# Altium schematic sheet Candunio.SchDoc
size A4
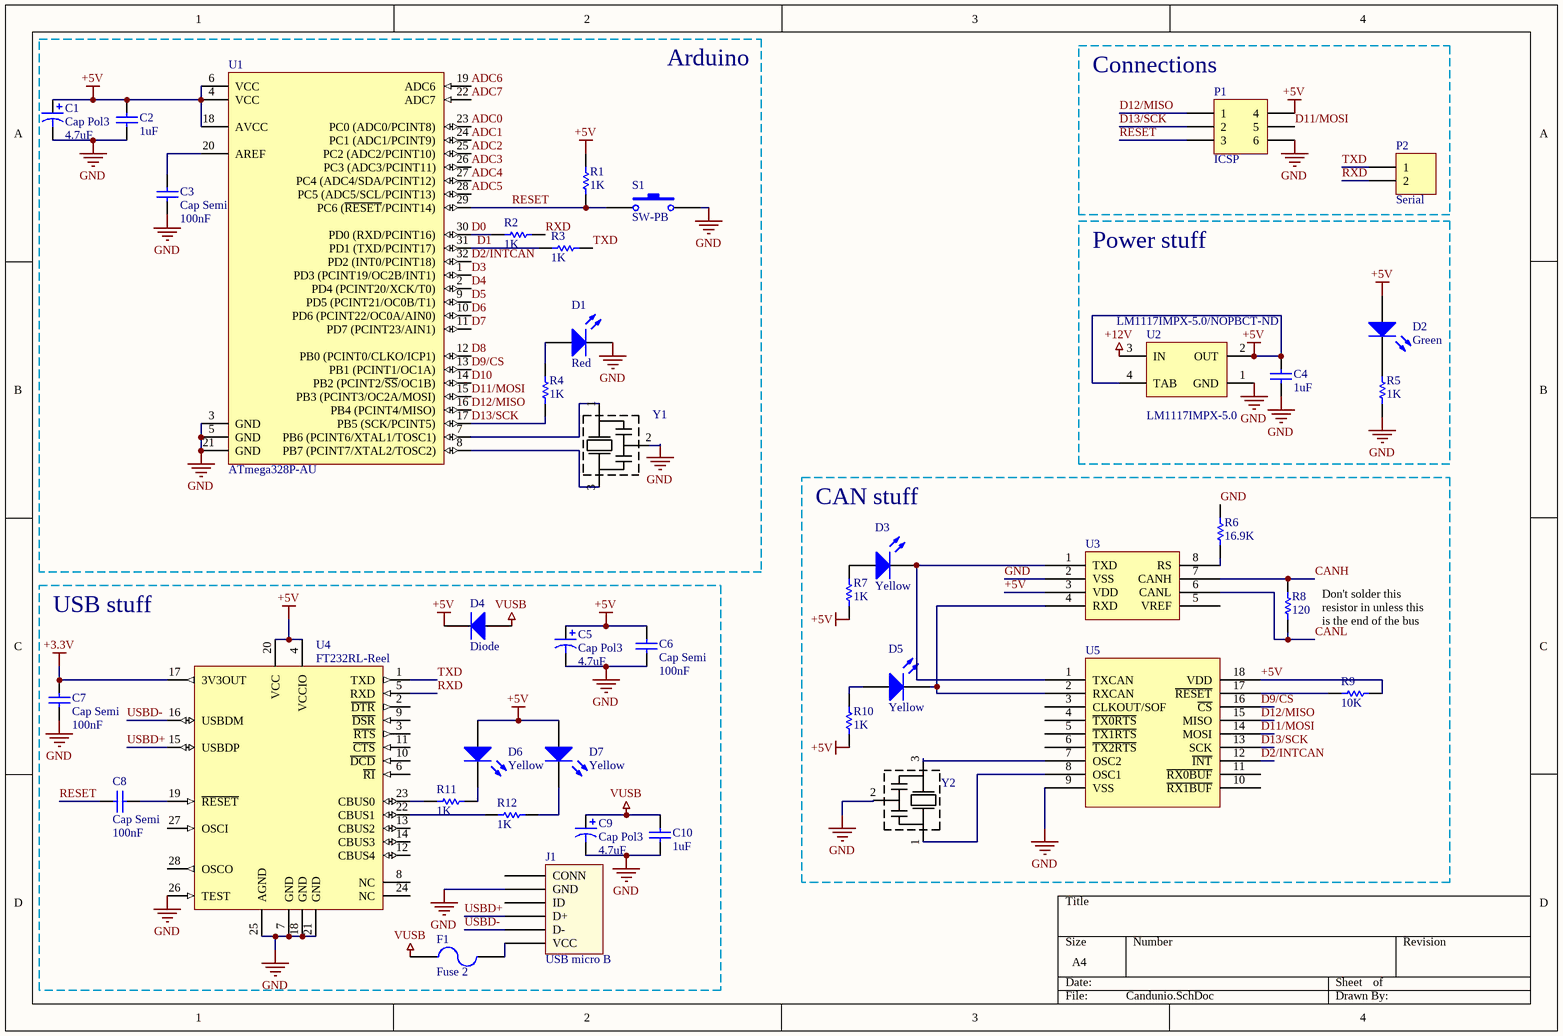
[diagram p0: Candunio.SchDoc]

## Parts
C1  Cap Pol3  value 4.7uF  [C1206]
C2  1uF  [C1206]
C3  Cap Semi  value 100nF  [C1206]
C4  1uF  [C1206]
C5  Cap Pol3  value 4.7uF  [C1206]
C6  Cap Semi  value 100nF  [C1206]
C7  Cap Semi  value 100nF  [C1206]
C8  Cap Semi  value 100nF  [C1206]
C9  Cap Pol3  value 4.7uF  [C1206]
C10  1uF  [C1206]
D1  Red  [3.2X1.6X1.1]
D2  Green  [3.2X1.6X1.1]
D3  Yellow  [3.2X1.6X1.1]
D4  Diode  [SMC]
D5  Yellow  [3.2X1.6X1.1]
D6  Yellow  [3.2X1.6X1.1]
D7  Yellow  [3.2X1.6X1.1]
F1  Fuse 2  [1812]
J1  USB micro B  [1050170001]
P1  ICSP  [HDR2X3_CEN]
P2  Serial  [HDR1X2]
R1  1K  [C1206]
R2  1K  [C1206]
R3  1K  [C1206]
R4  1K  [C1206]
R5  1K  [C1206]
R6  16.9K  [C1206]
R7  1K  [C1206]
R8  120  [C1206]
R9  10K  [C1206]
R10  1K  [C1206]
R11  1K  [C1206]
R12  1K  [C1206]
S1  SW-PB  [C1206]
U1  ATmega328P-AU  [32A_N]
U2  LM1117IMPX-5.0  Supplier Part Number: LM1117IMPX-5.0/NOPBCT-ND  [MP04A_N]
U3  MCP2551-E/SN  [SOIC127P600X175-8M]  (value not drawn)
U4  FT232RL-Reel  [SSOP-28_N]
U5  MCP2515-E/ST  [SOIC127P1030X265-18M]  (value not drawn)
Y1  CSTCE16M0V53-R0  [CSTCE16M0V53-R0]  (value not drawn)
Y2  CSTCE16M0V53-R0  [CSTCE16M0V53-R0]  (value not drawn)

## Blocks framed on the sheet
Arduino: C1-C3 D1 R1-R4 S1 U1 Y1
Connections: P1 P2
Power stuff: C4 D2 R5 U2
CAN stuff: D3 D5 R6-R10 U3 U5 Y2
USB stuff: C5-C10 D4 D6 D7 F1 J1 R11 R12 U4

## Nets
+3.3V: C7.1 U4.17(3V3OUT)
+5V: C1.1 C2.1 C4.1 C5.1 C6.1 D2.1(A) D4.2(K) D6.1(A) D7.1(A) P1.4 R1.1 R7.1 R9.2 R10.2 U1.4(VCC) U1.6(VCC) U1.18(AVCC) U2.2(OUT) U2.4(TAB) U3.3(VDD) U4.4(VCCIO) U4.20(VCC) U5.18(VDD)
+12V: U2.3(IN)
GND: C1.2 C2.2 C3.2 C4.2 C5.2 C6.2 C7.2 C9.2 C10.2 D1.2(K) J1.5(GND) P1.6 R5.2 R6.1 S1.2 U1.3(GND) U1.5(GND) U1.21(GND) U2.1(GND) U3.2(VSS) U4.7(GND) U4.18(GND) U4.21(GND) U4.25(AGND) U4.26(TEST) U5.9(VSS) Y1.2 Y2.2
VUSB: C9.1 C10.1 D4.1(A) F1.1
ADC0: U1.23(PC0_(ADC0/PCINT8))
ADC1: U1.24(PC1_(ADC1/PCINT9))
ADC2: U1.25(PC2_(ADC2/PCINT10))
ADC3: U1.26(PC3_(ADC3/PCINT11))
ADC4: U1.27(PC4_(ADC4/SDA/PCINT12))
ADC5: U1.28(PC5_(ADC5/SCL/PCINT13))
ADC6: U1.19(ADC6)
ADC7: U1.22(ADC7)
CANH: R8.1 U3.7(CANH)
CANL: R8.2 U3.6(CANL)
D0: R2.1 U1.30(PD0_(RXD/PCINT16))
D1: R3.1 U1.31(PD1_(TXD/PCINT17))
D2/INTCAN: U1.32(PD2_(INT0/PCINT18)) U5.12(~{INT})
D3: U1.1(PD3_(PCINT19/OC2B/INT1))
D4: U1.2(PD4_(PCINT20/XCK/T0))
D5: U1.9(PD5_(PCINT21/OC0B/T1))
D6: U1.10(PD6_(PCINT22/OC0A/AIN0))
D7: U1.11(PD7_(PCINT23/AIN1))
D8: U1.12(PB0_(PCINT0/CLKO/ICP1))
D9/CS: U1.13(PB1_(PCINT1/OC1A)) U5.16(~{CS})
D10: U1.14(PB2_(PCINT2/~{SS}/OC1B))
D11/MOSI: P1.5 U1.15(PB3_(PCINT3/OC2A/MOSI)) U5.14(MOSI)
D12/MISO: P1.1 U1.16(PB4_(PCINT4/MISO)) U5.15(MISO)
D13/SCK: P1.2 R4.2 U1.17(PB5_(SCK/PCINT5)) U5.13(SCK)
RESET: C8.1 P1.3 R1.2 S1.1 U1.29(PC6_(~{RESET}/PCINT14))
RXD: P2.2 R2.2 U4.5(RXD)
TXD: P2.1 R3.2 U4.1(TXD)
USBD+: J1.3(D+) U4.15(USBDP)
USBD-: J1.2(D-) U4.16(USBDM)
NetC3_1: C3.1 U1.20(AREF)
NetC8_2: C8.2 U4.19(~{RESET})
NetD1_1: D1.1(A) R4.1
NetD2_2: D2.2(K) R5.1
NetD3_1: D3.1(A) R7.2
NetD3_2: D3.2(K) U3.1(TXD) U5.1(TXCAN)
NetD5_1: D5.1(A) R10.1
NetD5_2: D5.2(K) U3.4(RXD) U5.2(RXCAN)
NetD6_2: D6.2(K) R11.2
NetD7_2: D7.2(K) R12.2
NetF1_2: F1.2 J1.1(VCC)
NetR6_2: R6.2 U3.8(RS)
NetR9_1: R9.1 U5.17(~{RESET})
NetR11_1: R11.1 U4.23(CBUS0)
NetR12_1: R12.1 U4.22(CBUS1)
NetU1_7: U1.7(PB6_(PCINT6/XTAL1/TOSC1)) Y1.1
NetU1_8: U1.8(PB7_(PCINT7/XTAL2/TOSC2)) Y1.3
NetU5_7: U5.7(OSC2) Y2.3
NetU5_8: U5.8(OSC1) Y2.1

Not connected (* = marked no-connect by the designer): J1 0(CONN) 4(ID); U3 5(VREF); U4 2(~{DTR}) 3(~{RTS}) 6(~{RI}) 8(NC) 9(~{DSR}) 10(~{DCD}) 11(~{CTS}) 12(CBUS4) 13(CBUS2) 14(CBUS3) 24(NC) 27(OSCI) 28(OSCO); U5 3(CLKOUT/SOF) 4(~{TX0RTS}) 5(~{TX1RTS}) 6(~{TX2RTS}) 10(~{RX1BUF}) 11(~{RX0BUF})

## Notes on the sheet
- (near R8) Don't solder this resistor in unless this is the end of the bus

## Library data of the parts
C1 C5 C9 = Cap Pol3: Polarized Capacitor (Surface Mount); Manufacturer: Kyocera AVX; Manufacturer Part Number: 12063C475KAT2A; Tolerance: 10%; Voltage Rating: 25V; Dielectric: X7R; Published: 8-Jun-2000; LatestRevisionDate: 29-May-2009; LatestRevisionNote: IPC-7351 Footprint Added.; PackageReference: C0805; Publisher: Altium Limited; PackageDescription: Chip Capacitor; Supplier 1: Digi-Key; Stock 1: 0; Pricing 1: 1=0.5, 10=0.345, 100=0.207, 500=0.15526, 1000=0.1311 (USD); Mount: Surface Mount; Case/Package: 1206; Number of Pins: 2; Case Code (Metric): 3216; Case Code (Imperial): 1206; Contact Plating: Tin,Matte; Min Operating Temperature: -55°C; Max Operating Temperature: 125°C; Capacitance: 4.7uF; Packaging: Tape and Reel; Package Quantity: 1; Voltage Rating (DC): 25V; Termination: SMD/SMT; Voltage: 25V; Length: 3.2mm; Height: 1.78mm; Width: 0.063inch; Thickness: 0.07inch; Depth: 1.6mm; Radiation Hardening: No; REACH SVHC: No SVHC; Lead Free: Lead Free; ComponentLink1URL: https://datasheet.ciiva.com/2988/cx7r-2988115.pdf; ComponentLink1Description: https://datasheet.ciiva.com/2988/cx7r-2988115.pdf; ComponentLink2URL: https://datasheet.ciiva.com/7833/84526-7833366.pdf; ComponentLink2Description: https://datasheet.ciiva.com/7833/84526-7833366.pdf; ComponentLink3URL: https://datasheet.ciiva.com/16315/cx7r-16315830.pdf; ComponentLink3Description: https://datasheet.ciiva.com/16315/cx7r-16315830.pdf; ComponentLink4URL: https://datasheet.ciiva.com/153/cx7r-153207.pdf; ComponentLink4Description: https://datasheet.ciiva.com/153/cx7r-153207.pdf; ComponentLink5URL: https://datasheet.ciiva.com/7833/84526-7833367.pdf; ComponentLink5Description: https://datasheet.ciiva.com/7833/84526-7833367.pdf; ComponentLink6URL: https://datasheet.ciiva.com/153/cx7r-153208.pdf; ComponentLink6Description: https://datasheet.ciiva.com/153/cx7r-153208.pdf; ComponentLink7URL: https://datasheet.ciiva.com/7833/cx7r-7833368.pdf; ComponentLink7Description: https://datasheet.ciiva.com/7833/cx7r-7833368.pdf; ComponentLink8URL: https://datasheet.ciiva.com/153/cx7r-153209.pdf; ComponentLink8Description: https://datasheet.ciiva.com/153/cx7r-153209.pdf; ComponentLink9URL: https://datasheet.ciiva.com/5417/cx7r-218113-5417949.pdf; ComponentLink9Description: https://datasheet.ciiva.com/5417/cx7r-218113-5417949.pdf; ComponentLink10URL: https://datasheet.ciiva.com/28611/cx7r-28611725.pdf; ComponentLink10Description: https://datasheet.ciiva.com/28611/cx7r-28611725.pdf; ComponentLink11URL: https://datasheet.ciiva.com/11786/0900766b80dc2409-11786382.pdf; ComponentLink11Description: https://datasheet.ciiva.com/11786/0900766b80dc2409-11786382.pdf; Supplier 2: Digi-Key; Supplier Part Number: 1276-1055-1-ND
C2 C4 C10 = Cap Semi: Capacitor (Semiconductor SIM Model); Manufacturer: Murata; Manufacturer Part Number: GRM31MR71H105KA88L; Material: Ceramic; Tolerance: 10%; Voltage Rating: 50V; Dielectric: X7R; Published: 8-Jun-2000; LatestRevisionDate: 29-May-2009; LatestRevisionNote: IPC-7351 Footprint Added.; PackageReference: C1206; Publisher: Altium Limited; PackageDescription: Chip Capacitor; Value: 1uF; Supplier 1: Digi-Key; Stock 1: 0; Mount: Surface Mount; Case/Package: 1206; Number of Pins: 2; Case Code (Metric): 3216; Case Code (Imperial): 1206; Min Operating Temperature: -55°C; Max Operating Temperature: 125°C; Capacitance: 1uF; Package Quantity: 1; Packaging: Tape and Reel; Voltage Rating (DC): 50V; Termination: SMD/SMT; Voltage: 50V; Length: 3.2mm; Height: 1.15mm; Width: 0.063inch; Thickness: 0.049inch; Depth: 1.6mm; REACH SVHC: No SVHC; Lead Free: Lead Free; ComponentLink1URL: https://datasheet.ciiva.com/16379/product-16379616.pdf; ComponentLink1Description: https://datasheet.ciiva.com/16379/product-16379616.pdf; ComponentLink2URL: https://datasheet.ciiva.com/14116/nmgrm-data-en-14116709.pdf; ComponentLink2Description: https://datasheet.ciiva.com/14116/nmgrm-data-en-14116709.pdf; ComponentLink3URL: https://datasheet.ciiva.com/22703/608985-22703384.pdf; ComponentLink3Description: https://datasheet.ciiva.com/22703/608985-22703384.pdf; ComponentLink4URL: https://datasheet.ciiva.com/3777/42grm31mr71h105ka8823-3777081.pdf; ComponentLink4Description: https://datasheet.ciiva.com/3777/42grm31mr71h105ka8823-3777081.pdf; ComponentLink5URL: https://datasheet.ciiva.com/6270/partnumbering-e-01-6270398.pdf; ComponentLink5Description: https://datasheet.ciiva.com/6270/partnumbering-e-01-6270398.pdf; ComponentLink6URL: https://datasheet.ciiva.com/6270/partnumbering-e-01-6270399.pdf; ComponentLink6Description: https://datasheet.ciiva.com/6270/partnumbering-e-01-6270399.pdf; ComponentLink7URL: https://datasheet.ciiva.com/29199/455056-da-01-en-vs-kondensator-1206-29199449.pdf; ComponentLink7Description: https://datasheet.ciiva.com/29199/455056-da-01-en-vs-kondensator-1206-29199449.pdf; ComponentLink8URL: https://datasheet.ciiva.com/29202/450923-da-01-de-vs-chip-kond-1206-1-0-uf-10pr-50-0v-x7r-29202718.pdf; ComponentLink8Description: https://datasheet.ciiva.com/29202/450923-da-01-de-vs-chip-kond-1206-1-0-uf-10pr-50-0v-x7r-29202718.pdf; Supplier 2: Digi-Key; Supplier Part Number: 490-14756-1-ND
C3 C6-C8 = Cap Semi: Capacitor (Semiconductor SIM Model); Manufacturer: Yageo; Manufacturer Part Number: CC1206KKX7R0BB104; Dielectric Material: Ceramic; Voltage Rating: 100V; Tolerance: 10%; Dielectric: X7R; Voltage: 63V; Published: 8-Jun-2000; LatestRevisionDate: 29-May-2009; LatestRevisionNote: IPC-7351 Footprint Added.; PackageReference: C1206; Publisher: Altium Limited; PackageDescription: Chip Capacitor; Supplier 1: Digi-Key; Stock 1: 0; Pricing 1: 1=0.32, 10=0.221, 100=0.1117, 500=0.07646, 1000=0.06763 (USD); Mount: Surface Mount; Case/Package: 1206; Number of Pins: 2; Case Code (Metric): 3216; Case Code (Imperial): 1206; Min Operating Temperature: -55°C; Max Operating Temperature: 125°C; Capacitance: 100nF; Packaging: Tape and Reel; Voltage Rating (DC): 100V; Package Quantity: 1; Termination: SMD/SMT; Composition: Ceramic; Length: 3.2mm; Height: 1.25mm; Width: 0.063inch; Depth: 1.6mm; Thickness: 0.057inch; Radiation Hardening: No; REACH SVHC: No SVHC; Lead Free: Lead Free; ComponentLink1URL: https://datasheet.ciiva.com/180/mlccorderingcode-180144.pdf; ComponentLink1Description: https://datasheet.ciiva.com/180/mlccorderingcode-180144.pdf; ComponentLink2URL: https://datasheet.ciiva.com/180/mlccorderingcode-180145.pdf; ComponentLink2Description: https://datasheet.ciiva.com/180/mlccorderingcode-180145.pdf; ComponentLink3URL: https://datasheet.ciiva.com/180/mlccorderingcode-180146.pdf; ComponentLink3Description: https://datasheet.ciiva.com/180/mlccorderingcode-180146.pdf; ComponentLink4URL: https://datasheet.ciiva.com/7978/1447671-7978227.pdf; ComponentLink4Description: https://datasheet.ciiva.com/7978/1447671-7978227.pdf; ComponentLink5URL: https://datasheet.ciiva.com/5425/upy-gp-np0-16v-to-50v-8-5425573.pdf; ComponentLink5Description: https://datasheet.ciiva.com/5425/upy-gp-np0-16v-to-50v-8-5425573.pdf; ComponentLink6URL: https://datasheet.ciiva.com/26829/getdatasheetpartid-403790-26829655.pdf; ComponentLink6Description: https://datasheet.ciiva.com/26829/getdatasheetpartid-403790-26829655.pdf; ComponentLink7URL: https://datasheet.ciiva.com/46391/1919308-46391993.pdf; ComponentLink7Description: https://datasheet.ciiva.com/46391/1919308-46391993.pdf; ComponentLink8URL: https://datasheet.ciiva.com/16981/upy-np0x7r-mv-100-to-630v-9-16981180.pdf; ComponentLink8Description: https://datasheet.ciiva.com/16981/upy-np0x7r-mv-100-to-630v-9-16981180.pdf; Supplier 2: Digi-Key; Supplier Part Number: 1276-1151-1-ND
D1 D3 D5-D7 = LED2: Typical RED, GREEN, YELLOW, AMBER GaAs LED; Manufacturer: Broadcom Avago; Manufacturer Part Number: HSMY-C150; Lens Colour: White,Clear; Viewing Angle: 170°; Lens Style: Diffused,Colorless,Rectangular; Wavelength: 586nm; Luminous Intensity: 8mcd; Forward Current: 20mA; Forward Voltage: 2.1V; Number of LEDs: 1; Reverse Voltage: 5V; Power Dissipation: 65mW; Lens Transparency: Diffused; Published: 8-Jun-2000; LatestRevisionDate: 17-Jul-2002; LatestRevisionNote: Re-released for DXP Platform.; PackageVersion: Feb-2002; PackageReference: 3.2X1.6X1.1; Publisher: Altium Limited; PackageDescription: SM LED; 2 Flat Leads; Supplier 1: Digi-Key; Stock 1: 0; Mount: Surface Mount; Case/Package: 1206; Number of Pins: 2; Colour: Yellow; Case Code (Metric): 3216; Case Code (Imperial): 1206; Contact Plating: Gold; Min Operating Temperature: -40°C; Max Operating Temperature: 85°C; Packaging: Tape and Reel; Package Quantity: 1; Illumination Colour: Yellow; Dominant Wavelength: 586nm; Test Current: 20mA; Number of Elements: 1; Power Rating: 65mW; Max Power Dissipation: 65mW; Voltage Rating (DC): 2.1V; Length: 3.2mm; Height: 1.1mm; Width: 1.6mm; Depth: 1.6mm; Radiation Hardening: No; REACH SVHC: No SVHC; Lead Free: Lead Free; ComponentLink1URL: https://datasheet.ciiva.com/15117/getdatasheetpartid-110528-15117488.pdf; ComponentLink1Description: https://datasheet.ciiva.com/15117/getdatasheetpartid-110528-15117488.pdf; ComponentLink2URL: https://datasheet.ciiva.com/11774/0900766b804a6539-11774578.pdf; ComponentLink2Description: https://datasheet.ciiva.com/11774/0900766b804a6539-11774578.pdf; ComponentLink3URL: https://datasheet.ciiva.com/19466/1557071-19466435.pdf; ComponentLink3Description: https://datasheet.ciiva.com/19466/1557071-19466435.pdf; ComponentLink4URL: https://datasheet.ciiva.com/14172/swseriehsmx-c150toc190-e-14172159.pdf; ComponentLink4Description: https://datasheet.ciiva.com/14172/swseriehsmx-c150toc190-e-14172159.pdf; ComponentLink5URL: https://datasheet.ciiva.com/29280/180507-da-01-en-chip-led-hsmy-c150-gelb-29280997.pdf; ComponentLink5Description: https://datasheet.ciiva.com/29280/180507-da-01-en-chip-led-hsmy-c150-gelb-29280997.pdf; Supplier 2: Digi-Key
  D1: Stock 2: 0; ComponentLink6URL: https://datasheet.ciiva.com/11773/0900766b804a6539-11773956.pdf; ComponentLink6Description: https://datasheet.ciiva.com/11773/0900766b804a6539-11773956.pdf; ComponentLink7URL: https://datasheet.ciiva.com/15117/getdatasheetpartid-142358-15117749.pdf; ComponentLink7Description: https://datasheet.ciiva.com/15117/getdatasheetpartid-142358-15117749.pdf; ComponentLink8URL: https://datasheet.ciiva.com/46426/313031-46426533.pdf; ComponentLink8Description: https://datasheet.ciiva.com/46426/313031-46426533.pdf; ComponentLink9URL: https://datasheet.ciiva.com/14172/swseriehsmx-c150toc190-e-14172156.pdf; ComponentLink9Description: https://datasheet.ciiva.com/14172/swseriehsmx-c150toc190-e-14172156.pdf; ComponentLink10URL: https://datasheet.ciiva.com/29281/180509-da-01-en-chip-led-hsmh-c150-rot-29281009.pdf; ComponentLink10Description: https://datasheet.ciiva.com/29281/180509-da-01-en-chip-led-hsmh-c150-rot-29281009.pdf; Supplier 3: Digi-Key; Supplier 4: Digi-Key; Supplier Part Number: 516-1440-1-ND
  D3 D5-D7: Supplier Part Number: 516-1442-1-ND
D2 = LED2: Typical RED, GREEN, YELLOW, AMBER GaAs LED; Manufacturer: Broadcom Avago; Manufacturer Part Number: HSMG-C150; Lens Colour: White,Clear; Viewing Angle: 170°; Lens Style: Diffused,Colorless,Rectangular; Luminous Intensity: 15mcd; Forward Voltage: 2.2V; Forward Current: 20mA; Wavelength: 572nm; Number of LEDs: 1; Power Rating: 65mW; Reverse Voltage: 5V; Lens Transparency: Diffused; Published: 8-Jun-2000; LatestRevisionDate: 17-Jul-2002; LatestRevisionNote: Re-released for DXP Platform.; PackageVersion: Feb-2002; PackageReference: 3.2X1.6X1.1; Publisher: Altium Limited; PackageDescription: SM LED; 2 Flat Leads; Mount: Surface Mount; Case/Package: 1206; Number of Pins: 2; Colour: Green,Yellow; Case Code (Metric): 3216; Case Code (Imperial): 1206; Contact Plating: Gold; Min Operating Temperature: -30°C; Max Operating Temperature: 85°C; Packaging: Tape and Reel; Package Quantity: 1; Illumination Colour: Green; Dominant Wavelength: 572nm; Test Current: 20mA; Number of Elements: 1; Power Dissipation: 65mW; Max Power Dissipation: 65mW; Length: 3.2mm; Height: 1.1mm; Width: 1.6mm; Depth: 1.6mm; Radiation Hardening: No; REACH SVHC: No SVHC; ComponentLink1URL: https://datasheet.ciiva.com/11774/0900766b804a6539-11774272.pdf; ComponentLink1Description: https://datasheet.ciiva.com/11774/0900766b804a6539-11774272.pdf; ComponentLink2URL: https://datasheet.ciiva.com/14172/swseriehsmx-c150toc190-e-14172162.pdf; ComponentLink2Description: https://datasheet.ciiva.com/14172/swseriehsmx-c150toc190-e-14172162.pdf; ComponentLink3URL: https://datasheet.ciiva.com/46426/313031-46426517.pdf; ComponentLink3Description: https://datasheet.ciiva.com/46426/313031-46426517.pdf; ComponentLink4URL: https://datasheet.ciiva.com/15117/getdatasheetpartid-110366-15117482.pdf; ComponentLink4Description: https://datasheet.ciiva.com/15117/getdatasheetpartid-110366-15117482.pdf; ComponentLink5URL: https://datasheet.ciiva.com/19466/1556369-19466015.pdf; ComponentLink5Description: https://datasheet.ciiva.com/19466/1556369-19466015.pdf; ComponentLink6URL: https://datasheet.ciiva.com/29280/180668-da-01-en-chip-led-hsmg-c150-gelb-gruen-29280632.pdf; ComponentLink6Description: https://datasheet.ciiva.com/29280/180668-da-01-en-chip-led-hsmg-c150-gelb-gruen-29280632.pdf; Supplier 1: Digi-Key; Supplier 2: Digi-Key; Supplier Part Number: 516-1443-1-ND
D4 = Diode: Default Diode; Published: 8-Jun-2000; LatestRevisionDate: 17-Jul-2002; LatestRevisionNote: Re-released for DXP Platform.; PackageVersion: Sep-1996; PackageReference: SMC; Publisher: Altium Limited; PackageDescription: DO-214-AB/SMC; 2 C-Bend Leads; Body 7.9 x 5.9 mm, inc. leads (LxW); Code_JEDEC: DO-214-AB; Supplier 1: Digi-Key; Supplier 2: Digi-Key; Supplier Part Number: SS1P3L-M3/84AGICT-ND
F1 = Fuse 2: Fuse; part number: MF-MSMF050-2; Manufacturer: Bourns; Max Current Rating: 100A; Hold Current: 500mA; Trip Current: 1A; Power Dissipation: 800mW; Voltage Rating: 15V; Resistance: 150mR; Time to Trip: 0.15s; Approvals: UL,CSA,TUV; Published: 8-Jun-2000; LatestRevisionDate: 17-Jul-2002; LatestRevisionNote: Re-released for DXP Platform.; PackageReference: PIN-W2/E2.8; Publisher: Altium Limited; PackageDescription: Thru-Hole; 2 Leads; Supplier 1: Digi-Key; Supplier Part Number: ‎MF-MSMF050-2CT-ND; Manufacturer Part Number: MF-MSMF050-2; Stock 1: 126000; Pricing 1: 2000=0.2898, 4000=0.28463, 6000=0.27945, 10000=0.2691 (USD); Mount: Surface Mount,PCB; Case/Package: 1812; Case Code (Metric): 4532; Case Code (Imperial): 1812; Number of Terminals: 2; Contact Plating: Gold; Terminal Material: Gold; Min Operating Temperature: -40°C; Max Operating Temperature: 85°C; Packaging: Tape and Reel; Package Quantity: 2000; Operating Supply Voltage: 15V; Current Rating: 100A; Termination: SMD/SMT; Voltage Rating (DC): 15V; Length: 4.73mm; Height: 0.85mm; Width: 3.41mm; Radiation Hardening: No; REACH SVHC: No SVHC; Lead Free: Lead Free; ComponentLink1URL: https://datasheet.ciiva.com/326/mfmsmf-326354.pdf; ComponentLink1Description: https://datasheet.ciiva.com/326/mfmsmf-326354.pdf; ComponentLink2URL: https://datasheet.ciiva.com/1228/1786007-1228155.pdf; ComponentLink2Description: https://datasheet.ciiva.com/1228/1786007-1228155.pdf; ComponentLink3URL: https://datasheet.ciiva.com/16205/mfmsmf-16205994.pdf; ComponentLink3Description: https://datasheet.ciiva.com/16205/mfmsmf-16205994.pdf; ComponentLink4URL: https://datasheet.ciiva.com/34302/1164200-34302041.pdf; ComponentLink4Description: https://datasheet.ciiva.com/34302/1164200-34302041.pdf; ComponentLink5URL: https://datasheet.ciiva.com/14537/70153434-14537737.pdf; ComponentLink5Description: https://datasheet.ciiva.com/14537/70153434-14537737.pdf; ComponentLink6URL: https://datasheet.ciiva.com/46395/1695373-46395287.pdf; ComponentLink6Description: https://datasheet.ciiva.com/46395/1695373-46395287.pdf; ComponentLink7URL: https://datasheet.ciiva.com/22749/1695373-22749079.pdf; ComponentLink7Description: https://datasheet.ciiva.com/22749/1695373-22749079.pdf; ComponentLink8URL: https://datasheet.ciiva.com/32426/mf-msmf-series-eng-tds-32426126.pdf; ComponentLink8Description: https://datasheet.ciiva.com/32426/mf-msmf-series-eng-tds-32426126.pdf; ComponentLink9URL: https://datasheet.ciiva.com/4501/mfmsmf-72300-4501655.pdf; ComponentLink9Description: https://datasheet.ciiva.com/4501/mfmsmf-72300-4501655.pdf; ComponentLink10URL: https://datasheet.ciiva.com/3019/mfmsmf-3019622.pdf; ComponentLink10Description: https://datasheet.ciiva.com/3019/mfmsmf-3019622.pdf; ComponentLink11URL: https://datasheet.ciiva.com/3019/mfmsmf-3019621.pdf; ComponentLink11Description: https://datasheet.ciiva.com/3019/mfmsmf-3019621.pdf; ComponentLink12URL: https://datasheet.ciiva.com/326/mfmsmf-326356.pdf; ComponentLink12Description: https://datasheet.ciiva.com/326/mfmsmf-326356.pdf; ComponentLink13URL: https://datasheet.ciiva.com/1274/1786007-1274499.pdf; ComponentLink13Description: https://datasheet.ciiva.com/1274/1786007-1274499.pdf; ComponentLink14URL: https://datasheet.ciiva.com/326/mfmsmf-326355.pdf; ComponentLink14Description: https://datasheet.ciiva.com/326/mfmsmf-326355.pdf; ComponentLink15URL: https://datasheet.ciiva.com/1274/1786007-1274498.pdf; ComponentLink15Description: https://datasheet.ciiva.com/1274/1786007-1274498.pdf; ComponentLink16URL: https://datasheet.ciiva.com/15226/getdatasheetpartid-117168-15226886.pdf; ComponentLink16Description: https://datasheet.ciiva.com/15226/getdatasheetpartid-117168-15226886.pdf; ComponentLink17URL: https://datasheet.ciiva.com/25894/mfmsmf-25894175.pdf; ComponentLink17Description: https://datasheet.ciiva.com/25894/mfmsmf-25894175.pdf
J1 = 1050170001: CONN SM TH USB MICRO MODIFIED FOR DRILL; Part number: WM1399CT-ND; Details: Modified from reference footprint for standard drill hits (rather than slots); Supplier 1: Digi-Key; Supplier Part Number: 609-4618-1-ND
P1 = Header 3X2A: Header, 3-Pin, Dual row; LatestRevisionDate: 17-Jul-2002; LatestRevisionNote: Re-released for DXP Platform.; Publisher: Altium Limited
P2 = Header 2: Header, 2-Pin; LatestRevisionDate: 17-Jul-2002; LatestRevisionNote: Re-released for DXP Platform.; Publisher: Altium Limited
R1-R5 R7 R10-R12 = Res1: Resistor; Manufacturer: Stackpole Electronics; Manufacturer Part Number: RNCP1206FTD1K00; Resistance: 1kR; Tolerance: 1%; Temperature Coefficient: 100ppm/°C; Max Power Dissipation: 500mW; Value: 1K; Supplier Part Number: 311-1.0KGRCT-ND; Supplier 1: Digi-Key; Supplier Part Number 1: RNCP1206FTD1K00DKR-ND; Stock 1: 679; Pricing 1: 1=0.1, 10=0.052, 100=0.0211, 1000=0.00949, 2500=0.00824 (USD); Mount: Surface Mount; Case/Package: 1206; Case Code (Metric): 3216; Case Code (Imperial): 1206; Contact Plating: Nickel,Tin,Matte; Min Operating Temperature: -55°C; Max Operating Temperature: 155°C; Packaging: Tape and Reel; Composition: Thin Film; Number of Terminations: 2; Length: 0.122inch; Height: 0.024inch; Width: 0.059inch; Radiation Hardening: No; Lead Free: Lead Free; ComponentLink1URL: http://www.seielect.com/Catalog/SEI-rncp.pdf; ComponentLink1Description: http://www.seielect.com/Catalog/SEI-rncp.pdf; ComponentLink2URL: https://www.seielect.com/catalog/SEI-Packaging.pdf; ComponentLink2Description: https://www.seielect.com/catalog/SEI-Packaging.pdf
R6 = Res1: Resistor; Manufacturer: TE Connectivity Holsworthy; Manufacturer Part Number: CRGH1206F16K9; Resistance: 16.9kR; Power Rating: 500mW; Tolerance: 1%; Voltage Rating: 200V; Temperature Coefficient: 100ppm/°C; Number of Resistors: 1; Value: 16.9K; Mount: Surface Mount; Case/Package: 1206; Case Code (Imperial): 1206; Case Code (Metric): 3216; Min Operating Temperature: -55°C; Max Operating Temperature: 125°C; Composition: Thick Film,Power resistor; Termination: Solder; Packaging: Tape and Reel; Number of Terminations: 2; Length: 3.1mm; Height: 0.55mm; Width: 1.55mm; ELV: Compliant; ComponentLink1URL: https://datasheet.ciiva.com/12573/eng-ds-1773204-g-12573853.pdf; ComponentLink1Description: https://datasheet.ciiva.com/12573/eng-ds-1773204-g-12573853.pdf; Supplier 1: Digi-Key; Supplier Part Number: 541-16.9KFCT-ND
R8 = Res1: Resistor; Manufacturer: Vishay; Manufacturer Part Number: CRCW1206120RFKEAHP; Resistance: 120R; Power Rating: 500mW; Voltage Rating: 200V; Temperature Coefficient: 100ppm/°C; Tolerance: 1%; Value: 120; Supplier 1: Digi-Key; Stock 1: 0; Case/Package: 1206; Weight: 0.000353oz; Case Code (Imperial): 1206; Case Code (Metric): 3216; Contact Plating: Tin; Min Operating Temperature: -55°C; Max Operating Temperature: 155°C; Packaging: Tape and Reel; Termination: SMD/SMT; Composition: Thick Film; Voltage Rating (DC): 200V; Package Quantity: 5000; Military Standard: Not; Length: 3.1mm; Height: 0.5mm; Width: 1.6mm; Depth: 1.6mm; Radiation Hardening: No; REACH SVHC: Unknown; Lead Free: Lead Free; ComponentLink1URL: https://datasheet.ciiva.com/8976/crcwhpe3-8976135.pdf; ComponentLink1Description: https://datasheet.ciiva.com/8976/crcwhpe3-8976135.pdf; ComponentLink2URL: https://datasheet.ciiva.com/48525/crcwhpe3-48525463.pdf; ComponentLink2Description: https://datasheet.ciiva.com/48525/crcwhpe3-48525463.pdf; ComponentLink3URL: https://datasheet.ciiva.com/7777/424479-7777433.pdf; ComponentLink3Description: https://datasheet.ciiva.com/7777/424479-7777433.pdf; ComponentLink4URL: https://datasheet.ciiva.com/7777/424479-7777434.pdf; ComponentLink4Description: https://datasheet.ciiva.com/7777/424479-7777434.pdf; Supplier 2: Digi-Key; Supplier Part Number: 541-120ECT-ND
R9 = Res1: Resistor; Manufacturer: Stackpole Electronics; Manufacturer Part Number: RNCP1206FTD10K0; Resistance: 10kR; Tolerance: 1%; Temperature Coefficient: 100ppm/°C; Max Power Dissipation: 500mW; Value: 10K; Supplier 1: Digi-Key; Supplier Part Number: RNCP1206FTD10K0CT-ND; Stock 1: 41487; Pricing 1: 1=0.1, 10=0.052, 100=0.0211, 1000=0.00949, 2500=0.00824 (USD); Mount: Surface Mount; Case/Package: 1206; Case Code (Metric): 3216; Case Code (Imperial): 1206; Min Operating Temperature: -55°C; Max Operating Temperature: 155°C; Packaging: Tape and Reel; Composition: Thin Film; Number of Terminations: 2; Length: 0.122inch; Height: 0.024inch; Width: 0.059inch; ComponentLink1URL: http://www.seielect.com/Catalog/SEI-rncp.pdf; ComponentLink1Description: http://www.seielect.com/Catalog/SEI-rncp.pdf
S1 = SW-PB: Switch; Manufacturer: ITT C&K; Manufacturer Part Number: KXT331LHS; Published: 24-Mar-1999; LatestRevisionDate: 17-Jul-2002; LatestRevisionNote: Re-released for DXP Platform.; PackageReference: SPST-2; Publisher: Altium Limited; PackageDescription: Switch; 2 Leads; Supplier 1: Digi-Key; Supplier Part Number: CKN10779CT-ND; Stock 1: 42500; Pricing 1: 8500=0.1264 (USD); ComponentLink1URL: https://www.ckswitches.com/media/1465/kxt3.pdf; ComponentLink1Description: https://www.ckswitches.com/media/1465/kxt3.pdf; ComponentLink2URL: http://www.ckswitches.com/media/1465/kxt3.pdf; ComponentLink2Description: http://www.ckswitches.com/media/1465/kxt3.pdf
U1 = ATmega328P-AU: 8-bit AVR Microcontroller, 32KB Flash, 1KB EEPROM, 2KB SRAM, 32-pin TQFP, Industrial Grade (-40°C to 85°C); Published: 1-Apr-2010; DatasheetVersion: revA, Jan-2010; PackageVersion: revB, Oct-2001; PackageReference: 32A; Publisher: Altium Limited; PackageDescription: 32-Lead, 7x7x1.0 mm Body, 0.8mm Lead Pitch, Thin Profile Plastic Quad Flat Package (TQFP); Supplier 1: Digi-Key; Supplier Part Number: ATMEGA328P-AU-ND; Supplier 2: Farnell; Supplier Part Number 2: 1715486; Supplier 3: Mouser; Supplier Part Number 3: 556-ATMEGA328P-AU; Code_JEDEC: MS-026-ABA; ComponentLink1Description: Manufacturer Link; ComponentLink1URL: http://www.atmel.com/products/avr/default.asp?; ComponentLink2Description: ATmega48A/48PA/88A/88PA/168A/168PA/328/328P Datasheet; ComponentLink2URL: http://www.atmel.com/dyn/resources/prod_documents/8271.pdf; ComponentLink3Description: ATmega48A/48PA/88A/88PA/168A/168PA/328/328P Summary; ComponentLink3URL: http://www.atmel.com/dyn/resources/prod_documents/8271S.pdf; ComponentLink4Description: Atmel.com Home; ComponentLink4URL: http://www.atmel.com
U2 = LM1117IMPX-5.0: 800mA Low-Dropout Linear Regulator, 4-pin SOT-223; Manufacturer: National Semiconductor; PackageTopMarking: XYTT*N06B; PowerWise: N; CompType: LDO IC; Published: 1-Mar-2010; DatasheetVersion: Apr-2006; PackageVersion: revB, Apr-2003; PackageReference: MP04A; Publisher: Altium Limited; PackageDescription: Molded SOT-223, 6.50 x 3.56 x 1.6mm Body, 4 Lead, 2.3mm Pitch; PartNumber: LM1117IMPX-5.0/NOPBCT-ND; RoHS: N; PinCount: 4; Code_JEDEC: TO-261-AA; Code_IPC: SOT223-4; ComponentLink1Description: LM1117 Datasheet; ComponentLink1URL: http://www.national.com/ds/LM/LM1117.pdf; ComponentLink2Description: LM1117 Web Page; ComponentLink2URL: http://www.national.com/pf/LM/LM1117.html; ComponentLink3Description: MP04A Package Page; ComponentLink3URL: http://www.national.com/packaging/folders/mp04a.html; Supplier 1: Digi-Key
U3 = MCP2551-E/SN: SOIC; Supplier 1: Digi-Key; Supplier Part Number: MCP2551T-E/SNCT-ND
U4 = FT232RL-Reel: USB UART Asynchronous Serial Data Transfer Chip, SSOP-28, Tape and Reel; Manufacturer: FTDI; Interface: RS-232,RS-422,RS-485,UART; Number of Channels: 1; Max Supply Voltage: 5.25V; Min Supply Voltage: 3.3V; Data Rate: 12Mbps; Operating Supply Current: 15mA; Voltage: 5V; Published: 19-Aug-2010; DatasheetVersion: ver 2.07, Jul-2010; PackageVersion: 2010; PackageReference: SSOP-28; Publisher: Altium Limited; PackageDescription: 28-Pin Small Outline Package 0.65 mm Pitch; ComponentLink1Description: Manufacturer Link; ComponentLink1URL: http://www.ftdichip.com/Products/ICs/FT232R.htm; ComponentLink2Description: Datasheet; ComponentLink2URL: http://www.ftdichip.com/Support/Documents/DataSheets/ICs/DS_FT232R.pdf; Supplier 1: Digi-Key; Manufacturer Part Number: FT232RL-REEL; Stock 1: 216496; Pricing 1: 1=4.5, 10=4.05, 100=3.65, 250=3.25, 500=2.85002, 1000=2.65 (USD); Mount: Surface Mount; Case/Package: SSOP; Number of Pins: 28; Weight: 0.080001oz; Min Operating Temperature: -40°C; Max Operating Temperature: 85°C; Packaging: Tape and Reel; Package Quantity: 2000; Number of Transceivers: 1; Length: 10.2mm; Height: 1.75mm; Width: 5.3mm; Radiation Hardening: No; REACH SVHC: No SVHC; Lead Free: Lead Free; ComponentLink3URL: https://datasheet.ciiva.com/34304/2161019-34304054.pdf; ComponentLink3Description: https://datasheet.ciiva.com/34304/2161019-34304054.pdf; ComponentLink4URL: https://datasheet.ciiva.com/1787/ds-ft232r-1787047.pdf; ComponentLink4Description: https://datasheet.ciiva.com/1787/ds-ft232r-1787047.pdf; ComponentLink5URL: https://datasheet.ciiva.com/1787/ds-ft232r-1787048.pdf; ComponentLink5Description: https://datasheet.ciiva.com/1787/ds-ft232r-1787048.pdf; ComponentLink6URL: https://datasheet.ciiva.com/1787/ds-ft232r-1787049.pdf; ComponentLink6Description: https://datasheet.ciiva.com/1787/ds-ft232r-1787049.pdf; ComponentLink7URL: https://datasheet.ciiva.com/4787/ds-ft232r-11534-4787658.pdf; ComponentLink7Description: https://datasheet.ciiva.com/4787/ds-ft232r-11534-4787658.pdf; ComponentLink8URL: https://datasheet.ciiva.com/15150/getdatasheetpartid-643207-15150506.pdf; ComponentLink8Description: https://datasheet.ciiva.com/15150/getdatasheetpartid-643207-15150506.pdf; ComponentLink9URL: https://datasheet.ciiva.com/16200/ds-ft232r-16200652.pdf; ComponentLink9Description: https://datasheet.ciiva.com/16200/ds-ft232r-16200652.pdf; ComponentLink10URL: https://datasheet.ciiva.com/26841/ft232rl-reel-26841080.pdf; ComponentLink10Description: https://datasheet.ciiva.com/26841/ft232rl-reel-26841080.pdf; Supplier 2: Digi-Key; Supplier Part Number: 768-1007-1-ND
U5 = MCP2515-E/ST: SOIC; Supplier 1: Digi-Key; Supplier Part Number: MCP2515T-I/SOCT-ND
Y1 Y2 = CSTCE16M0V53-R0: Manufacturer: Murata; Manufacturer Part Number: CSTCE16M0V53C-R0; Frequency: 16MHz; Frequency Tolerance: 0.5%; Frequency Stability: 0.15%; Capacitance: 15pF; Supplier Part Number: 490-17948-1-ND; Supplier 1: Digi-Key; Stock 1: 0; Mount: Surface Mount; Case/Package: SMD/SMT; Number of Pins: 3; Contact Plating: Gold; Min Operating Temperature: -40°C; Max Operating Temperature: 125°C; Packaging: Tape and Reel; Composition: Ceramic; Package Quantity: 3000; Termination: SMD/SMT; Tolerance: 0.5%; Length: 0.126inch; Height: 0.031inch; Width: 0.051inch; REACH SVHC: No SVHC; Lead Free: Lead Free; ComponentLink1URL: https://datasheet.ciiva.com/16430/cstce16m0v53c-r0-16430704.pdf; ComponentLink1Description: https://datasheet.ciiva.com/16430/cstce16m0v53c-r0-16430704.pdf; ComponentLink2URL: https://datasheet.ciiva.com/14132/ceralock-eng-bro-14132709.pdf; ComponentLink2Description: https://datasheet.ciiva.com/14132/ceralock-eng-bro-14132709.pdf; ComponentLink3URL: https://datasheet.ciiva.com/29617/l0430e-29617948.pdf; ComponentLink3Description: https://datasheet.ciiva.com/29617/l0430e-29617948.pdf; ComponentLink4URL: https://datasheet.ciiva.com/29617/l0430e-29617949.pdf; ComponentLink4Description: https://datasheet.ciiva.com/29617/l0430e-29617949.pdf; ComponentLink5URL: https://datasheet.ciiva.com/29617/l0430e-29617950.pdf; ComponentLink5Description: https://datasheet.ciiva.com/29617/l0430e-29617950.pdf; ComponentLink6URL: https://datasheet.ciiva.com/26812/getdatasheetpartid-418508-26812063.pdf; ComponentLink6Description: https://datasheet.ciiva.com/26812/getdatasheetpartid-418508-26812063.pdf